# Altium schematic sheet strain_amp.SchDoc
size A4; SheetNumber: 3; SheetTotal: 4
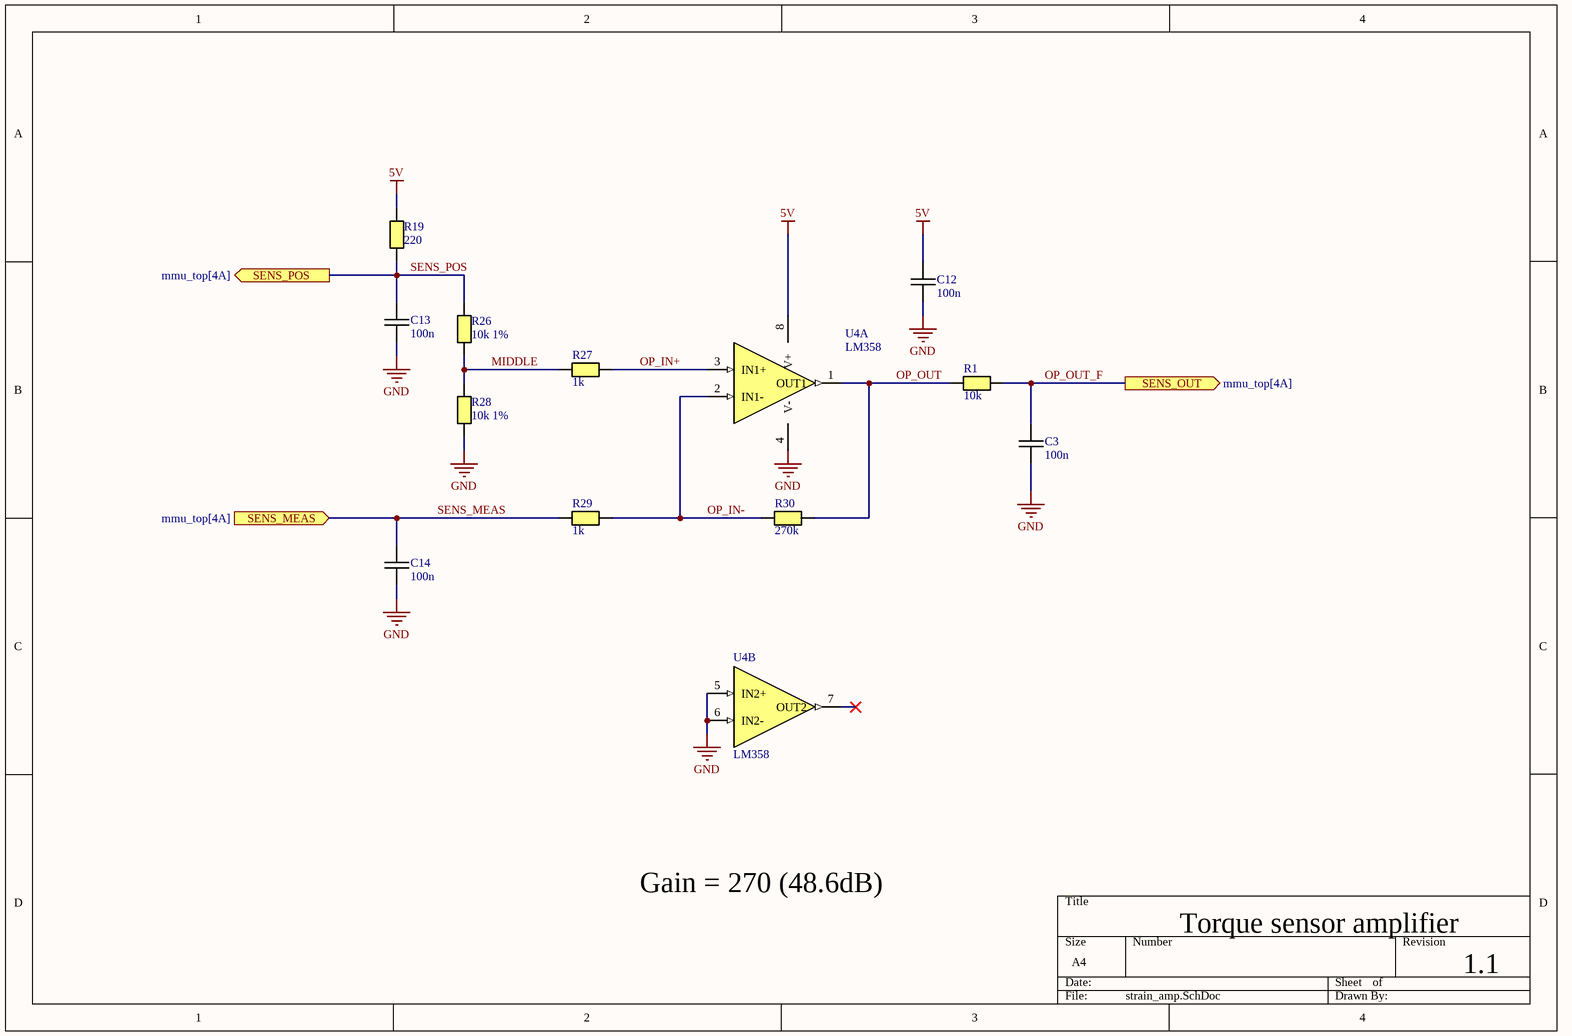
[diagram p0: strain_amp.SchDoc]

## Parts
C3  100n  [CAPC0603(1608)55_N]
C12  100n  [CAPC0603(1608)55_N]
C13  100n  [CAPC0603(1608)55_N]
C14  100n  [CAPC0603(1608)55_N]
R1  10k  [RESC0603(1608)_N]
R19  220  [RESC0603(1608)_N]
R26  10k 1%  [RESC0603(1608)_N]
R27  1k  [RESC0603(1608)_N]
R28  10k 1%  [RESC0603(1608)_N]
R29  1k  [RESC0603(1608)_N]
R30  270k  [RESC0603(1608)_N]
U4  LM358  [SO8]  (parts A,B of 2)

## Ports
SENS_MEAS (in, see mmu_top[4A]), SENS_OUT (out, see mmu_top[4A]), SENS_POS (out, see mmu_top[4A])

## Nets
5V: C12.1 R19.2 U4.8(V+)
GND: C3.2 C12.2 C13.2 C14.2 R28.1 U4.4(V-) U4.5(IN2+) U4.6(IN2-)
MIDDLE: R26.1 R27.1 R28.2
OP_IN+: R27.2 U4.3(IN1+)
OP_IN-: R29.2 R30.1 U4.2(IN1-)
OP_OUT: R1.1 R30.2 U4.1(OUT1)
OP_OUT_F: C3.1 R1.2 ; port SENS_OUT
SENS_MEAS: C14.1 R29.1 ; port SENS_MEAS
SENS_POS: C13.1 R19.1 R26.2 ; port SENS_POS

Not connected (* = marked no-connect by the designer): U4 7(OUT2)*

## Notes on the sheet
- Gain = 270 (48.6dB)
- Torque sensor amplifier
- 1.1

## Library data of the parts
C3 C12-C14 = Capacitor M: Ceramic capacitor Medium density; Value: 100n
R1 R19 R26-R30 = Resistor M: Resistor Medium Density
  R1: Value: 10k
  R19: Value: 220
  R26 R28: Value: 10k 1%
  R27 R29: Value: 1k
  R30: Value: 270k